# EAGLE design top (EAGLE 7.2.0)
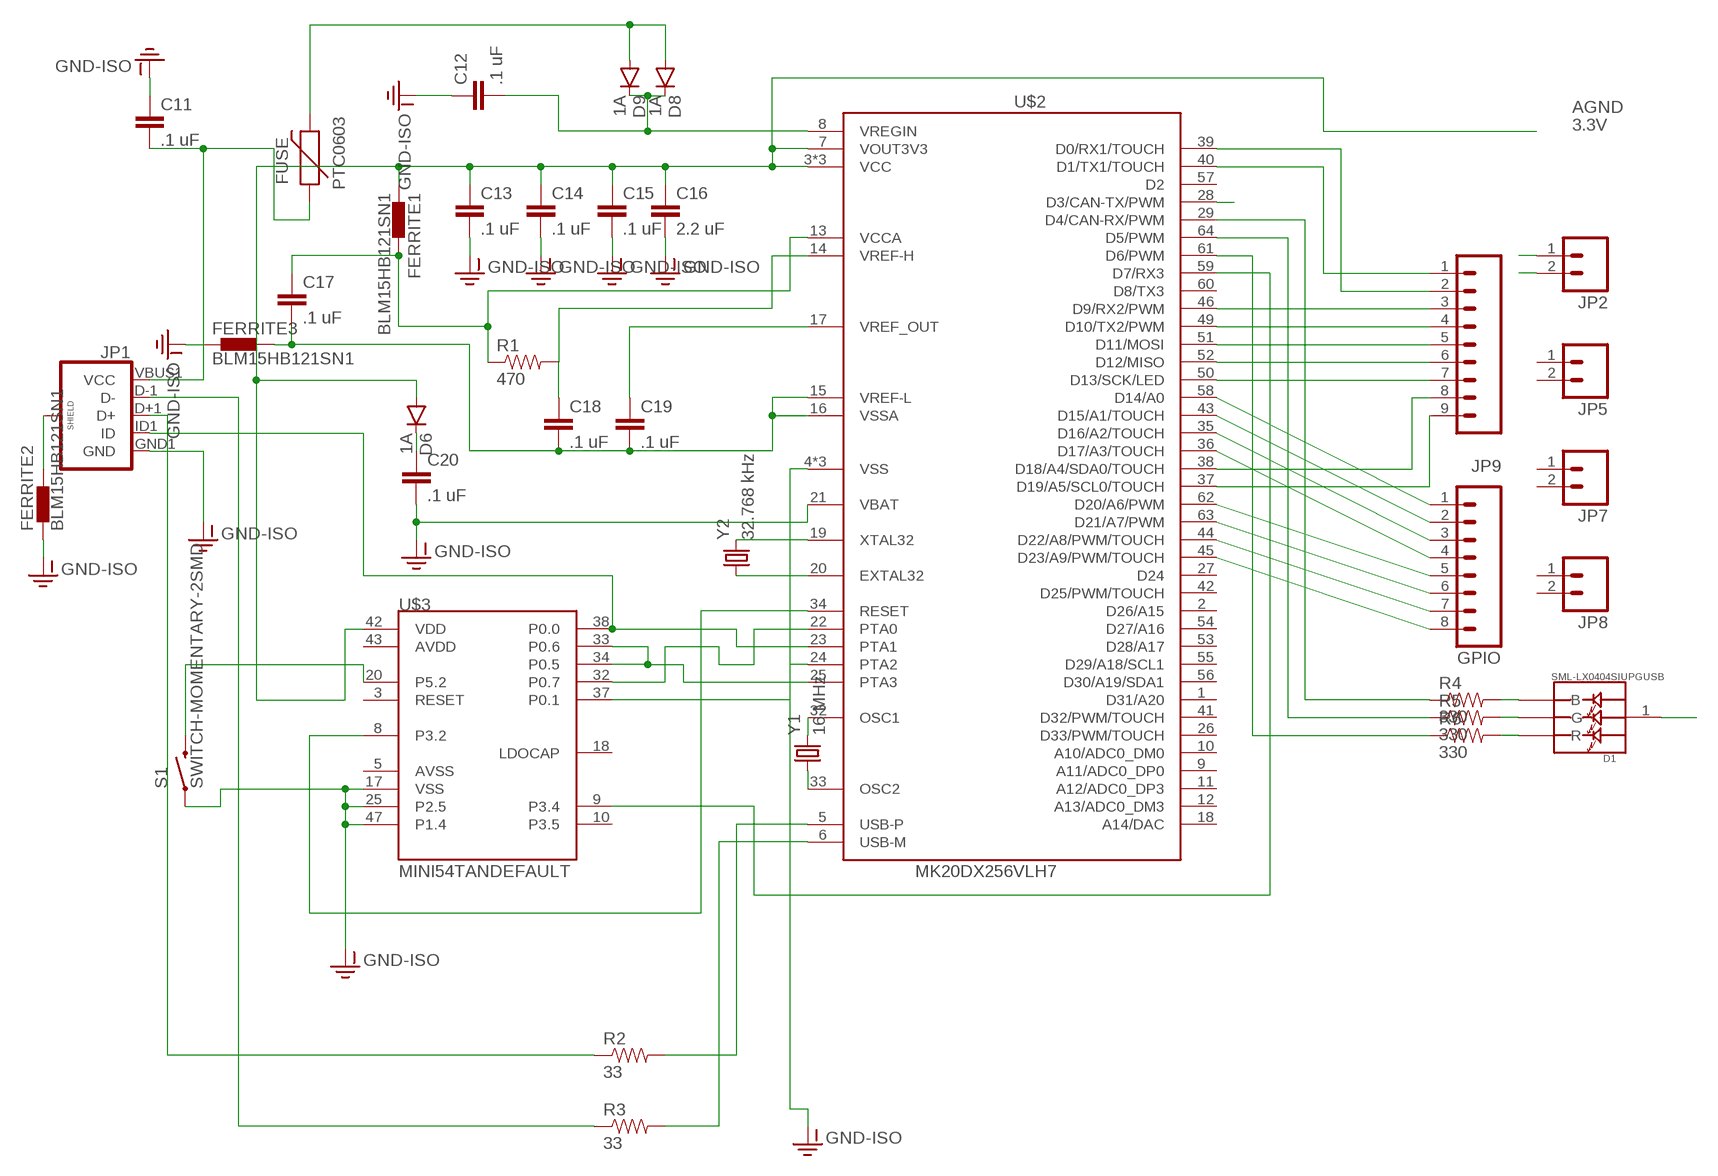
[diagram p0: schematic, sheet 1]

## Parts
C11  .1 uF  CAP0603-CAP  [0603-CAP]
C12  .1 uF  CAP0603-CAP  [0603-CAP]
C13  .1 uF  CAP0603-CAP  [0603-CAP]
C14  .1 uF  CAP0603-CAP  [0603-CAP]
C15  .1 uF  CAP0603-CAP  [0603-CAP]
C16  2.2 uF  CAP0603-CAP  [0603-CAP]
C17  .1 uF  CAP0603-CAP  [0603-CAP]
C18  .1 uF  CAP0603-CAP  [0603-CAP]
C19  .1 uF  CAP0603-CAP  [0603-CAP]
C20  .1 uF  CAP0603-CAP  [0603-CAP]
D1  SML-LX0404SIUPGUSB  [1MM_SQ_4PAD]
D6  1A  DIODEBAS16  [SOD-323]
D8  1A  DIODEBAS16  [SOD-323]
D9  1A  DIODEBAS16  [SOD-323]
FERRITE1  BLM15HB121SN1  [0402]
FERRITE2  BLM15HB121SN1  [0402]
FERRITE3  BLM15HB121SN1  [0402]
FUSE  PTC0603  [0603]
GPIO  M08SILK_FEMALE_PTH  [1X08]
JP1  USB_MICROB_PLUGCONN-11752  [USB-B-MICRO-SMD_V03]
JP2  M02LOCK  [1X02_LOCK]
JP5  M02LOCK  [1X02_LOCK]
JP7  M02LOCK  [1X02_LOCK]
JP8  M02LOCK  [1X02_LOCK]
JP9  M09  [1X09]
R1  470  RESISTOR0603  [0603-RES]
R2  33  RESISTOR0603  [0603-RES]
R3  33  RESISTOR0603  [0603-RES]
R4  330  RESISTOR0603  [0603-RES]
R5  330  RESISTOR0603  [0603-RES]
R6  330  RESISTOR0603  [0603-RES]
S1  SWITCH-MOMENTARY-2SMD  [TACTILE-SWITCH-SMD]
U$2  MK20DX256VLH7  [QFP50P1200X1200X160-64N]
U$3  MINI54TANDEFAULT  [QFP50P900X900X160-48N]
Y1  16 MHz  CRYSTAL5X3  [CRYSTAL-SMD-5X3]
Y2  32.768 kHz  CRYSTAL5X3  [CRYSTAL-SMD-5X3]

## Nets
3.3V: C13.1 C14.1 C15.1 C16.1 D1.1(VDD) D6.A FERRITE1.1 JP2.1 U$2.3(VCC) U$2.7(VOUT3V3) U$2.30(VCC) U$2.48(VCC) U$3.42(VDD)
AGND: C17.2 C18.2 C19.2 FERRITE3.2 U$2.15(VREF-L) U$2.16(VSSA)
CE: JP9.3 U$2.46(D9/RX2/PWM)
GND-ISO: C11.1 C12.1 C13.2 C14.2 C15.2 C16.2 C20.2 FERRITE2.1 FERRITE3.1 JP1.GND1(GND) JP2.2 S1.1 U$2.4(VSS) U$2.21(VBAT) U$2.31(VSS) U$2.47(VSS) U$3.17(VSS) U$3.25(P2.5) U$3.47(P1.4)
N$1: C19.1 U$2.17(VREF_OUT)
N$2: C12.2 D8.C D9.C U$2.8(VREGIN)
N$3: U$2.14(VREF-H)
N$4: C17.1 FERRITE1.2 R1.1 U$2.13(VCCA)
N$5: C18.1 R1.2
N$6: FERRITE2.2 JP1.SHIELD1(SHIELD) JP1.SHIELD2(SHIELD) JP1.SHIELD3(SHIELD)
N$8: S1.3 U$3.20(P5.2)
N$9: C20.1 D6.C
N$10: JP1.D+1(D+) R2.1
N$11: U$2.34(RESET) U$3.8(P3.2)
N$12: JP1.ID1(ID) U$2.23(PTA1) U$3.38(P0.0)
N$13: U$2.25(PTA3) U$3.33(P0.6) U$3.34(P0.5)
N$14: U$2.22(PTA0) U$3.32(P0.7)
N$15: U$2.24(PTA2) U$3.37(P0.1)
N$16: U$2.59(D7/RX3) U$3.9(P3.4)
N$18: JP1.D-1(D-) R3.1
N$19: R2.2 U$2.5(USB-P)
N$20: R3.2 U$2.6(USB-M)
N$22: JP9.4 U$2.49(D10/TX2/PWM)
N$23: U$2.19(XTAL32) Y2.3
N$24: U$2.20(EXTAL32) Y2.1
N$25: U$2.32(OSC1) Y1.3
N$26: U$2.33(OSC2) Y1.1
N$27: JP9.5 U$2.51(D11/MOSI)
N$28: JP9.6 U$2.52(D12/MISO)
N$29: GPIO.1 U$2.58(D14/A0)
N$30: GPIO.2 U$2.43(D15/A1/TOUCH)
N$31: GPIO.3 U$2.35(D16/A2/TOUCH)
N$32: D1.3(B) R4.2
N$33: D1.4(G) R5.2
N$35: D1.2(R) R6.2
N$36: GPIO.4 U$2.36(D17/A3/TOUCH)
N$37: GPIO.5 U$2.62(D20/A6/PWM)
N$38: GPIO.6 U$2.63(D21/A7/PWM)
N$39: GPIO.7 U$2.44(D22/A8/PWM/TOUCH)
N$40: GPIO.8 U$2.45(D23/A9/PWM/TOUCH)
N$41: R5.1 U$2.64(D5/PWM)
N$45: U$2.28(D3/CAN-TX/PWM)
N$62: R4.1 U$2.29(D4/CAN-RX/PWM)
N$63: C11.2 FUSE.1 JP1.VBUS1(VCC)
N$64: R6.1 U$2.61(D6/PWM)
SCK: JP9.7 U$2.50(D13/SCK/LED)
SCL_T: JP9.9 U$2.37(D19/A5/SCL0/TOUCH)
SDA_T: JP9.8 U$2.38(D18/A4/SDA0/TOUCH)
T_RX: JP9.2 U$2.39(D0/RX1/TOUCH)
T_TX: JP9.1 U$2.40(D1/TX1/TOUCH)
VIN: D8.A D9.A FUSE.2
Unconnected: JP5.1 JP5.2 JP7.1 JP7.2 JP8.1 JP8.2 U$2.1(D31/A20) U$2.2(D26/A15) U$2.9(A11/ADC0_DP0) U$2.10(A10/ADC0_DM0) U$2.11(A12/ADC0_DP3) U$2.12(A13/ADC0_DM3) U$2.18(A14/DAC) U$2.26(D33/PWM/TOUCH) U$2.27(D24) U$2.41(D32/PWM/TOUCH) U$2.42(D25/PWM/TOUCH) U$2.53(D28/A17) U$2.54(D27/A16) U$2.55(D29/A18/SCL1) U$2.56(D30/A19/SDA1) U$2.57(D2) U$2.60(D8/TX3) U$3.3(RESET) U$3.5(AVSS) U$3.10(P3.5) U$3.18(LDOCAP) U$3.43(AVDD)

## Library data of the parts
C11-C20 = SparkFun-Passives:CAP: Capacitor Standard 0603 ceramic capacitor, and 0.1" leaded capacitor.
D1 = leds:SML-LX0404SIUPGUSB: 1mm^2 RGB LED; DIGIKEY: 67-2125-1-ND
D6 D8 D9 = SparkFun-DiscreteSemi:DIODE: Diode These are standard reverse protection diodes and small signal diodes. SMA package can handle up to about 1A. SOD-323 can handle about 200mA. What the SOD-323 package when ordering, there are some mfgs out there that are 5-pin packages.; PROD_ID: DIO-09646; VALUE: 250mA/100V
FERRITE1-FERRITE3 = inductors:BLM15H: EMIFIL (R) Chip Ferrite Bead for GHz Noise Source: http://www.murata.com/ Ferrite Bead BLM15H.pdf
FUSE = SparkFun-PowerIC:PTC: Resettable Fuse PTC Resettable Fuse. Spark Fun Electronics SKU : COM-08357
GPIO = SparkFun-Connectors:M08: Header 8 Standard 8-pin 0.1" header. Use with straight break away headers (SKU : PRT-00116), right angle break away headers (PRT-00553), swiss pins (PRT-00743), machine pins (PRT-00117), and female headers (PRT-00115).; PROD_ID: CONN-08438
JP1 = SparkFun-Connectors:USB_MICROB_PLUG: USB Micro-B connectors Some male, some female. Watch your step!; PROD_ID: CONN-11752
JP2 JP5 JP7 JP8 = SparkFun-Connectors:M02: Standard 2-pin 0.1" header. Use with - straight break away headers ( PRT-00116) - right angle break away headers (PRT-00553) - swiss pins (PRT-00743) - machine pins (PRT-00117) - female headers (PRT-00115) Molex polarized connector foot print use with: PRT-08233 with associated crimp pins and housings. 2.54_SCREWTERM for use with PRT-10571. 3.5mm Screw Terminal footprints for PRT-08084 5mm Screw Terminal footprints for use with PRT-08432
JP9 = SparkFun-Connectors:M09: Header 9 Standard 9-pin 0.1" header. Use with straight break away headers (SKU : PRT-00116), right angle break away headers (PRT-00553), swiss pins (PRT-00743), machine pins (PRT-00117), and female headers (PRT-00115).
R1-R6 = SparkFun-Resistors:RESISTOR: Resistor Basic schematic elements and footprints for 0603, 1206, and PTH resistors.
S1 = SparkFun-Electromechanical:SWITCH-MOMENTARY-2: Various NO switches- pushbuttons, reed, etc; PROD_ID: SWCH-08247
U$2 = Teensy_3_Series_Chip_v1.2:MK20DX256VLH7: This is a footprint for the MK20dx256VHL7, the chip at the heart of the Teensy 3.1. Notable upgrades over the Teensy 3.0 include more Flash Memory, RAM, a DAC output, additional ADC pins, etc. Remember, if you want to use USB, VOut3v3 has to be attached to the 3.3V bus.
U$3 = Teensy_3_Series_Chip_v1.2:MINI54TAN: MINI54TAN Bootloader from PJRC.com, preprogrammed with Teensy 3.0 bootloader. https://www.pjrc.com/store/ic_mini54_tqfp.html
Y1 Y2 = SparkFun-FreqCtrl:CRYSTAL: Various standard crystals. Proven footprints.; PROD_ID: XTAL-08218

## Board
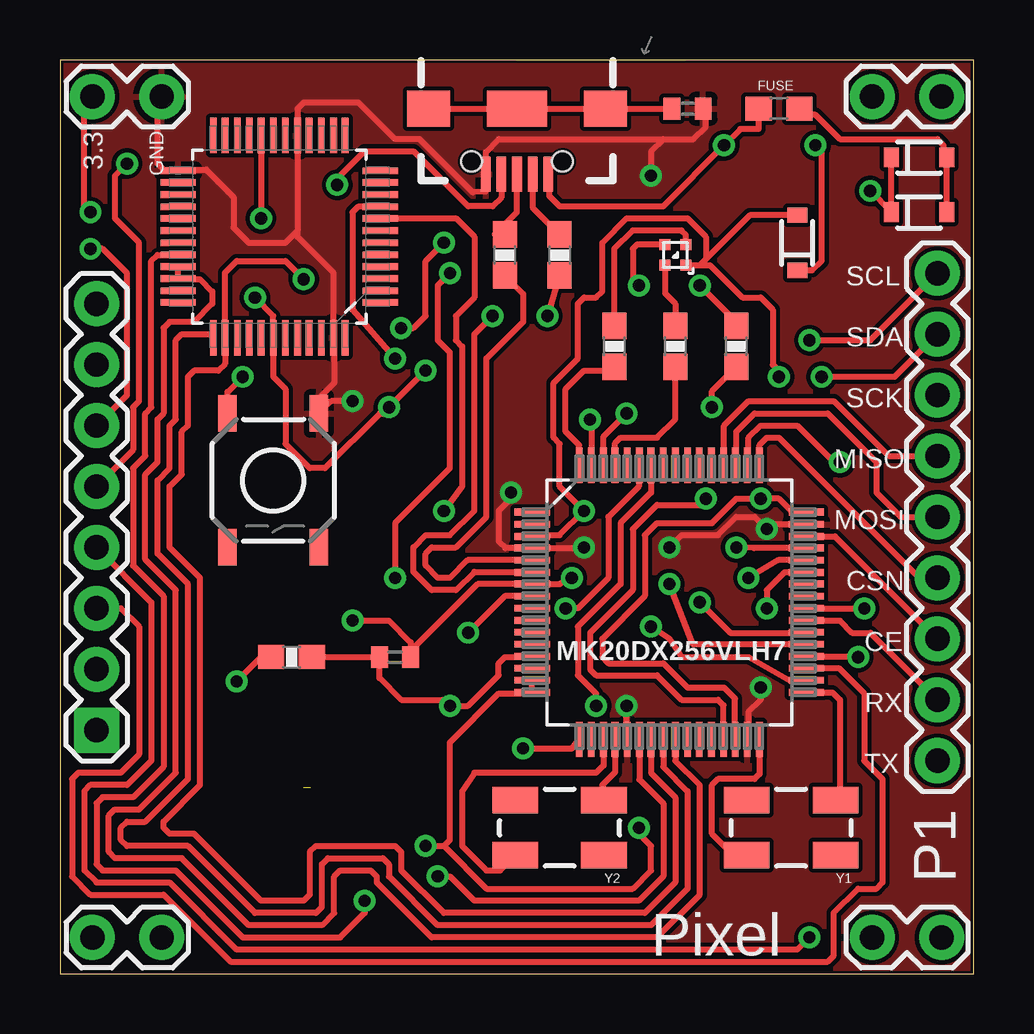
[diagram p1: board, top side]
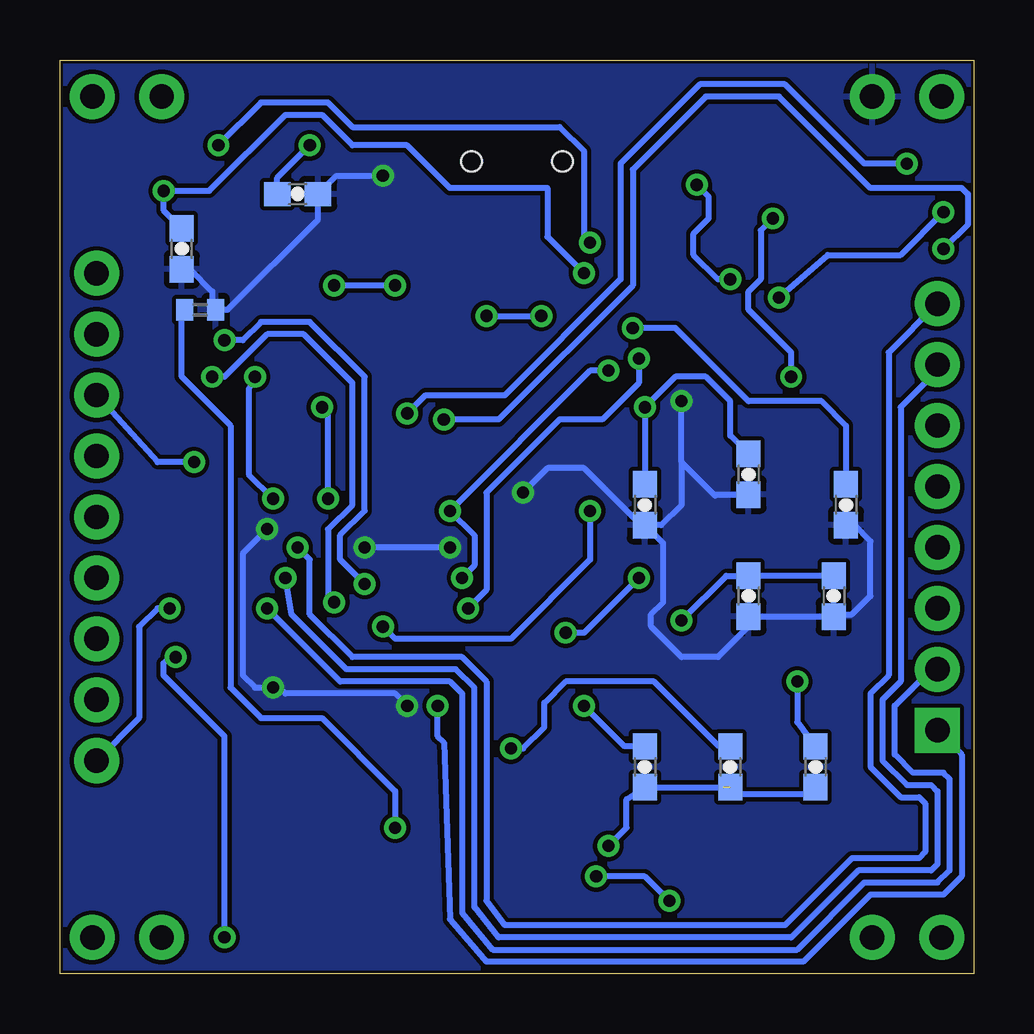
[diagram p2: board, bottom side, seen from below]

Size 38.1 x 38.1 mm. Coordinates in mm from the lower left corner, seen from the top.
Outline: 0,0 38.1,0 38.1,38.1 0,38.1 0,0
Copper layers (1*16): Top 0.035mm / dielectric 1.5mm / Bottom 0.035mm
Design rules "default *": minimum track width 10mil, minimum drill 20mil, track to track 7mil, track to pad 7mil, pad to pad 8mil, via to via 8mil, smd to smd 5mil, copper to edge 5mil, drill to drill 5mil, minimum pad ring 10mil, minimum via ring 8mil, stop-mask expansion 4mil, vias tented up to drill 0mil, thermal gap 10mil

### Footprints (pad centres in the part's own frame; a part is rotated, then mirrored left to right if it is on the bottom)
0603-CAP = smd 1.1 x 1: 1 -0.85,0; 2 0.85,0
1MM_SQ_4PAD = smd 0.457 x 0.457: 1 0.432,0.432; 2 0.432,-0.432; 3 -0.432,-0.432; 4 -0.432,0.432
SOD-323 = smd 0.63 x 0.83: A 1.15,0; C -1.15,0
0402 = smd 0.7 x 0.9: 1 -0.65,0; 2 0.65,0
0603 = smd 1.1 x 1: 1 -0.85,0; 2 0.85,0
1X08 = drill 1.016 pad 1.88 square: 1 0,0 | drill 1.016 pad 1.88: 2 2.54,0; 3 5.08,0; 4 7.62,0; 5 10.16,0; 6 12.7,0; 7 15.24,0; 8 17.78,0
USB-B-MICRO-SMD_V03 = smd 1.45 x 0.4: D+1 2.725,0; D-1 2.725,0.65; GND1 2.725,-1.3; ID1 2.725,-0.65; VBUS1 2.725,1.3 | smd 1.5 x 1.8: SHIELD1 0,3.685; SHIELD2 0,-3.685 | smd 1.5 x 2.5: SHIELD3 0,0 | hole 0.85: 2.2,1.9; 2.2,-1.9
1X02_LOCK = drill 1.016 pad 1.88: 1 -0.178,0; 2 2.718,0
1X09 = drill 1.016 pad 1.88: 1 0,0; 2 2.54,0; 3 5.08,0; 4 7.62,0; 5 10.16,0; 6 12.7,0; 7 15.24,0; 8 17.78,0; 9 20.32,0
0603-RES = smd 1.1 x 1: 1 -0.85,0; 2 0.85,0
TACTILE-SWITCH-SMD = smd 1.524 x 0.762: 1 -2.794,1.905; 2 2.794,1.905; 3 -2.794,-1.905; 4 2.794,-1.905
QFP50P1200X1200X160-64N = smd 1.473 x 0.279: 1 -5.715,3.759; 2 -5.715,3.251; 3 -5.715,2.743; 4 -5.715,2.261; 5 -5.715,1.753; 6 -5.715,1.245; 7 -5.715,0.762; 8 -5.715,0.254; 9 -5.715,-0.254; 10 -5.715,-0.762; 11 -5.715,-1.245; 12 -5.715,-1.753; 13 -5.715,-2.261; 14 -5.715,-2.743; 15 -5.715,-3.251; 16 -5.715,-3.759; 33 5.715,-3.759; 34 5.715,-3.251; 35 5.715,-2.743; 36 5.715,-2.261; 37 5.715,-1.753; 38 5.715,-1.245; 39 5.715,-0.762; 40 5.715,-0.254; 41 5.715,0.254; 42 5.715,0.762; 43 5.715,1.245; 44 5.715,1.753; 45 5.715,2.261; 46 5.715,2.743; 47 5.715,3.251; 48 5.715,3.759 | smd 0.279 x 1.473: 17 -3.759,-5.715; 18 -3.251,-5.715; 19 -2.743,-5.715; 20 -2.261,-5.715; 21 -1.753,-5.715; 22 -1.245,-5.715; 23 -0.762,-5.715; 24 -0.254,-5.715; 25 0.254,-5.715; 26 0.762,-5.715; 27 1.245,-5.715; 28 1.753,-5.715; 29 2.261,-5.715; 30 2.743,-5.715; 31 3.251,-5.715; 32 3.759,-5.715; 49 3.759,5.715; 50 3.251,5.715; 51 2.743,5.715; 52 2.261,5.715; 53 1.753,5.715; 54 1.245,5.715; 55 0.762,5.715; 56 0.254,5.715; 57 -0.254,5.715; 58 -0.762,5.715; 59 -1.245,5.715; 60 -1.753,5.715; 61 -2.261,5.715; 62 -2.743,5.715; 63 -3.251,5.715; 64 -3.759,5.715
QFP50P900X900X160-48N = smd 1.473 x 0.279: 1 -4.216,2.743; 2 -4.216,2.261; 3 -4.216,1.753; 4 -4.216,1.245; 5 -4.216,0.762; 6 -4.216,0.254; 7 -4.216,-0.254; 8 -4.216,-0.762; 9 -4.216,-1.245; 10 -4.216,-1.753; 11 -4.216,-2.261; 12 -4.216,-2.743; 25 4.216,-2.743; 26 4.216,-2.261; 27 4.216,-1.753; 28 4.216,-1.245; 29 4.216,-0.762; 30 4.216,-0.254; 31 4.216,0.254; 32 4.216,0.762; 33 4.216,1.245; 34 4.216,1.753; 35 4.216,2.261; 36 4.216,2.743 | smd 0.279 x 1.473: 13 -2.743,-4.216; 14 -2.261,-4.216; 15 -1.753,-4.216; 16 -1.245,-4.216; 17 -0.762,-4.216; 18 -0.254,-4.216; 19 0.254,-4.216; 20 0.762,-4.216; 21 1.245,-4.216; 22 1.753,-4.216; 23 2.261,-4.216; 24 2.743,-4.216; 37 2.743,4.216; 38 2.261,4.216; 39 1.753,4.216; 40 1.245,4.216; 41 0.762,4.216; 42 0.254,4.216; 43 -0.254,4.216; 44 -0.762,4.216; 45 -1.245,4.216; 46 -1.753,4.216; 47 -2.261,4.216; 48 -2.743,4.216
CRYSTAL-SMD-5X3 = smd 1.9 x 1.1: 1 -1.85,-1.15; 2 1.85,-1.15; 3 1.85,1.15; 4 -1.85,1.15

### Placement (x,y rotation side)
C11  28.19,32.51 180 bottom
C12  33.02,30.23 90 bottom
C13  13.72,19.56 270 bottom
C14  9.4,20.83 270 bottom
C15  9.4,15.75 270 bottom
C16  5.84,15.75 270 bottom
C17  13.72,8.64 270 bottom
C18  6.6,8.64 270 bottom
C19  10.16,8.64 270 bottom
C20  5.33,19.56 270 bottom
D1  25.65,29.97 270 top
D6  30.73,30.48 90 top
D8  35.81,31.75 0 top
D9  35.81,34.04 0 top
FERRITE1  13.97,13.21 180 top
FERRITE2  26.16,36.07 180 top
FERRITE3  32.26,27.69 180 bottom
FUSE  29.97,36.07 0 top
GPIO  1.52,10.16 90 top
JP1  19.05,36.07 270 top
JP2  1.52,36.58 0 top
JP5  34.04,36.58 0 top
JP7  34.04,1.52 0 top
JP8  1.52,1.52 0 top
JP9  36.58,8.89 90 top
R1  9.65,13.21 180 top
R2  18.54,29.97 270 top
R3  20.83,29.97 270 top
R4  28.19,26.16 90 top
R5  23.11,26.16 90 top
R6  25.65,26.16 90 top
S1  8.89,20.57 270 top
U$2  25.4,15.49 0 top
U$3  9.14,30.73 180 top
Y1  30.48,6.1 180 top
Y2  20.83,6.1 180 top

### Tracks (layer width: path | path; a pad name or v marks a point on that pad's centre or on a via)
3.3V  (via drill 0.51)
  Top 0.254: U$2.48 30.53,19.25 29.97,19.81 v29.21,19.81 28.19,19.81 27.18,18.8 24.89,18.8 24.38,18.29 24.38,15.75 22.61,13.97 22.61,13.21 22.86,12.95 25.15,12.95 26.16,11.94 27.69,11.94 28.14,11.48 U$2.30 | U$2.3 20.27,18.24 20.32,18.29 20.83,18.29 v21.84,19.3 20.83,20.32 20.83,22.1 20.57,22.35 20.57,24.64 21.59,25.65 21.59,27.94 21.84,28.19 22.35,28.19 22.61,28.45 22.61,30.48 23.62,31.5 26.16,31.5 26.92,30.73 26.92,29.79 | v21.34,16.51 20.83,16.26 U$2.7 17.41,16.26 14.62,13.46 FERRITE1.1 14.62,13.83 13.72,14.73 v12.19,14.73 | D1.1 26.67,29.54 | 26.67,29.54 27.1,29.54 28.45,28.19 29.21,28.19 29.72,27.69 29.72,25.4 29.97,25.15 v29.97,24.89 | 26.92,29.79 26.67,29.54 | v8.13,28.19 8.89,27.43 U$3.42 8.89,24.89 9.4,24.38 9.4,22.1 10.41,21.08 11.05,21.08 13.34,23.37 13.46,23.37 v13.72,23.62 v15.24,25.15 | D6.A 28.76,31.63 26.92,29.79 | v1.27,31.75 1.02,32 1.02,35.99 1.35,36.32 JP2.1
  Bottom 0.254: v29.21,19.81 30.23,20.83 30.23,24.38 v29.97,24.89 | 7.87,28.19 v8.13,28.19 6.1,29.97 3.05,29.97 v1.27,31.75 | v15.24,25.15 16,25.15 v21.84,19.3 20.83,18.29 20.83,17.02 v21.34,16.51 | v12.19,14.73 10.33,16.6 C15.1 C16.1 | C13.1 v13.72,23.62 12.45,24.89 11.18,24.89 10.16,23.88 10.16,22.44 C14.1
AGND  (via drill 0.51)  (1 unrouted)
  Top 0.254: U$2.15 U$2.16 19.63,11.68 18.29,11.68 16.26,9.65 16.26,5.59 16,5.33 | v15.24,5.33 16,5.33 | 16,5.33 17.78,3.56 23.88,3.56 24.64,4.32 24.64,5.33 24.13,5.84 v24.13,6.1
  Bottom 0.254: v15.24,5.33 14.48,6.1 14.48,7.28 C17.2 10.46,7.79 | FERRITE3.2 33.02,27.57 33.02,24.89 30.99,22.86 30.99,11.94 29.72,10.67 27.18,10.67 24.13,7.62 v24.13,6.1 | C18.2 7.15,7.49 9.86,7.49 C19.2
CE
  Top 0.254: U$2.46 32.31,18.24 JP9.3
GND-ISO  (via drill 0.51)
  Top 0.254: U$2.31 28.65,10.36 28.7,10.41 28.7,10.92 29.21,11.43 v29.21,11.94 | U$2.21 23.62,9.8 v23.62,11.18 | v21.84,17.78 21.36,17.75 U$2.4 18.57,17.75 18.29,18.03 18.29,19.3 18.8,19.81 v18.8,20.07 | U$2.47 29.67,18.75 v29.46,18.54 28.96,19.05 28.19,19.05 27.43,18.29 25.91,18.29 v25.4,17.78 | 25.15,34.8 18.29,34.8 17.75,34.26 JP1.GND1 17.75,32.62 17.2,32.58 14.99,34.8 13.97,34.8 12.45,36.32 10.16,36.32 9.91,36.07 U$3.17 9.91,30.99 | 25.15,34.8 26.42,34.8 26.92,35.31 26.92,35.96 FERRITE2.1 | 9.91,30.99 9.91,30.73 11.4,29.23 U$3.47 11.43,26.49 11.43,24.64 10.79,24 S1.1 11.3,23.88 v12.19,23.88 | 9.91,30.99 9.4,30.48 7.87,30.48 7.24,31.11 7.24,32.38 6.1,33.53 4.98,33.53 U$3.25 4.88,33.53 4.32,33.53 4.06,33.78 4.06,36.14 4.24,36.32 JP2.2 | 25.15,34.8 24.64,34.29 v24.64,33.27
  Bottom 0.254: v23.62,11.18 24.13,11.68 28.7,11.68 28.96,11.94 v29.21,11.94 29.97,11.94 30.48,12.45 30.48,17.53 v29.46,18.54 | v21.84,17.78 v25.4,17.78 | 12.19,21.34 10.79,19.94 10.75,19.98 C14.2 | 12.19,21.34 v12.19,23.88 | v18.8,20.07 17.78,21.08 16.26,21.08 13.97,18.8 13.8,18.8 C13.2 | v24.64,33.27 26.58,33.27 C11.1 27.34,31.45 31.11,27.69 FERRITE3.1 31.75,27.83 31.75,28.45 32.68,29.38 C12.1 | C13.2 12.95,17.95 12.95,15.49 13.46,14.99 13.46,14.48 12.19,13.21 10.67,13.21 9.4,14.48 C15.2 C16.2 5.75,14.99 5.08,14.99 4.32,15.75 4.32,18.03 4.99,18.71 C20.2 | 12.19,21.34 12.19,19.56 13.04,18.71 C13.2
  pour Bottom: -71.37,115.82 -77.72,115.82 -77.72,-51.82 192.02,-51.82 192.02,114.3 -71.37,114.3
  pour Top: -60.71,109.22 179.32,109.22 179.32,-43.94 -60.96,-43.94 -60.96,109.22
N$1  (via drill 0.51)
  Top 0.254: v19.3,9.4 21.34,9.4 21.59,9.73 U$2.17
  Bottom 0.254: v19.3,9.4 18.8,9.4 17.91,10.29 17.91,11.3 17.02,12.19 13.34,12.19 10.63,9.49 C19.1
N$2  (via drill 0.51)
  Top 0.254: D9.C D8.C v33.77,32.64 | U$2.8 18.54,15.75 v17.02,14.22 | v13.97,16.51 13.97,18.8 16.26,21.08 16.26,25.91 15.75,26.42 15.75,28.7 v16.26,29.21
  Bottom 0.254: 16.76,14.22 v17.02,14.22 16.26,14.22 v13.97,16.51 | v16.26,29.21 17.78,30.73 17.78,32.77 21.84,32.77 23.62,34.54 25.91,34.54 27.18,35.81 28.7,35.81 31.87,32.64 v33.77,32.64 33.77,31.83 C12.2
N$4  (via drill 0.51)
  Top 0.254: U$2.13 19.66,13.21 18.54,13.21 18.29,12.95 18.29,12.45 17.02,11.18 v16.26,11.18 16,11.43 14.22,11.43 13.32,12.33 FERRITE1.2 | FERRITE1.2 13.32,12.84 | R1.1 FERRITE1.2
  Bottom 0.254: v16.26,11.18 14.57,9.49 C17.1
N$5  (via drill 0.51)
  Top 0.254: R1.2 8.38,13.21 v7.37,12.19
  Bottom 0.254: v7.37,12.19 7.37,10.5 C18.1
N$6
  Top 0.254: JP1.SHIELD2 JP1.SHIELD3 JP1.SHIELD1 FERRITE2.2
N$8  (via drill 0.51)
  Top 0.254: U$3.20 v8.38,31.5 | S1.3 6.99,24.26 v7.62,24.89
  Bottom 0.254: v7.62,24.89 7.62,25.91 9.4,27.69 9.4,28.45 8.89,28.96 8.89,30.99 v8.38,31.5
N$9  (via drill 0.51)
  Top 0.254: v16,30.48 15.24,29.72 15.24,27.43 14.73,26.92 v14.22,26.92 | D6.C 31.36,29.33 31.75,29.72 31.75,34.29 v31.5,34.54
  Bottom 0.254: v14.22,26.92 12.45,26.92 9.4,23.88 6.35,23.88 5.33,22.86 C20.1 | v31.5,34.54 29.72,36.32 26.92,36.32 25.91,35.31 17.27,35.31 16.26,34.29 16.26,30.73 v16,30.48
N$10
  Top 0.254: R2.1 18.12,30.82 19.05,31.75 JP1.D+1
N$11  (via drill 0.51)
  Top 0.254: U$3.8 16.51,31.5 17.27,30.73 17.27,28.19 16.51,27.43 16.51,26.42 16.76,26.16 16.76,20.32 v16,19.3 | 31.06,12.19 U$2.34 30.53,12.24 30.48,12.19 28.7,13.21 25.91,13.21 25.4,13.97 v24.64,14.48
  Bottom 0.254: v16,19.3 16,17.27 19.3,13.97 24.13,13.97 v24.64,14.48
N$12  (via drill 0.51)
  Top 0.254: 6.86,26.49 U$3.38 | U$3.38 6.88,25.43 6.6,25.15 5.59,25.15 5.33,24.89 5.33,22.86 5.08,22.61 5.08,20.83 4.57,20.32 4.57,17.78 5.84,16.51 5.84,7.87 4.32,6.35 4.32,6.1 4.57,5.84 5.59,5.84 8.38,3.05 10.16,3.05 10.41,3.3 10.41,5.08 10.67,5.33 13.97,5.33 14.22,5.08 14.22,4.32 16,2.54 24.38,2.54 25.65,3.81 25.65,7.37 24.64,8.38 U$2.23 | U$3.38 6.88,29.23 7.37,29.72 9.4,29.72 v10.16,28.96 | v11.56,32.89 11.56,33.15 12.7,34.29 14.73,34.29 17.02,32 18.03,32 18.4,32.37 JP1.ID1
  Bottom 0.254: v10.16,28.96 10.67,28.96 11.68,29.97 11.68,30.86 11.05,31.5 11.05,32.38 v11.56,32.89
N$13
  Top 0.254: U$3.33 U$3.34 4.9,28.96 5.84,28.96 6.35,28.45 6.35,27.94 5.59,27.18 4.57,27.18 4.32,26.92 4.32,23.37 4.06,23.11 4.06,21.34 3.56,20.83 3.56,17.27 4.83,16 4.83,8.38 3.3,6.86 2.29,6.86 2.03,6.6 2.03,5.08 2.29,4.83 5.08,4.83 7.87,2.03 10.92,2.03 11.43,2.54 11.43,4.06 11.68,4.32 12.95,4.32 13.21,4.06 13.21,3.81 15.49,1.52 24.89,1.52 26.67,3.3 26.67,7.87 25.65,8.89 U$2.25
N$14  (via drill 0.51)
  Top 0.254: 24.13,9.75 U$2.22 24.16,8.1 25.15,7.11 25.15,4.06 24.13,3.05 17.27,3.05 16.26,4.06 v15.75,4.06 | U$3.32 4.06,29.97 3.81,29.72 3.81,23.62 3.56,23.37 3.56,21.59 3.05,21.08 3.05,17.02 4.32,15.75 4.32,8.64 3.05,7.37 1.78,7.37 1.52,7.11 1.52,4.57 1.78,4.32 4.83,4.32 7.62,1.52 11.68,1.52 12.7,2.54 v12.7,3.05
  Bottom 0.254: v15.75,4.06 13.72,4.06 v12.7,3.05
N$15
  Top 0.254: U$3.37 6.25,26.67 5.08,26.67 4.83,26.42 4.83,23.11 4.57,22.86 4.57,21.08 4.06,20.57 4.06,17.53 5.33,16.26 5.33,8.13 3.56,6.35 2.79,6.35 2.54,6.1 2.54,5.59 2.79,5.33 5.33,5.33 8.13,2.54 10.67,2.54 10.92,2.79 10.92,4.57 11.18,4.83 13.46,4.83 13.72,4.57 13.72,4.06 15.75,2.03 24.64,2.03 26.16,3.56 26.16,7.62 25.15,8.64 U$2.24
N$16  (via drill 0.51)
  Top 0.254: U$2.59 24.13,21.18 24.13,20.32 22.86,19.05 22.86,16.51 21.59,15.24 v21.08,15.24 | U$3.9 12.42,31.98 12.19,31.75 12.19,27.69 v13.97,25.65
  Bottom 0.254: v13.97,25.65 13.97,24.64 15.49,23.11 17.27,23.11 20.32,20.07 20.32,16 v21.08,15.24
N$18
  Top 0.254: JP1.D-1 19.7,31.95 R3.1
N$19
  Top 0.254: U$2.5 16.99,17.25 16.26,16.51 15.75,16.51 15.24,17.02 15.24,17.53 15.49,17.78 16.51,17.78 17.78,19.05 17.78,25.65 19.3,27.18 19.3,28.36 R2.2
N$20  (via drill 0.51)
  Top 0.254: R3.2 v20.32,27.43 | U$2.6 19.66,16.76 17.27,16.76 16.51,16 15.49,16 14.73,16.76 14.73,17.78 15.24,18.29 16.26,18.29 17.27,19.3 17.27,26.67 v18.03,27.43
  Bottom 0.254: v20.32,27.43 v18.03,27.43
N$22
  Top 0.254: JP9.4 35.81,16.51 29.97,22.35 29.46,22.35 29.16,22.05 U$2.49
N$23
  Top 0.254: U$2.19 22.66,8.69 22.35,8.38 17.27,8.38 16.76,7.62 16.76,5.33 17.78,4.32 18.35,4.32 Y2.3
N$24
  Top 0.254: U$2.20 23.14,8.41 22.61,7.87 22.61,7.17 Y2.1
N$25
  Top 0.254: Y1.3 28.07,4.95 27.18,5.84 27.18,7.87 27.43,8.13 28.96,8.13 29.16,8.33 U$2.32
N$26
  Top 0.254: U$2.33 32.21,11.73 32.51,11.43 32.51,7.43 Y1.1
N$27
  Top 0.254: U$2.51 28.19,21.26 28.19,22.61 28.96,23.37 32,23.37 34.04,21.34 34.04,20.07 35.05,19.05 JP9.5
N$28
  Top 0.254: U$2.52 27.69,21.23 27.69,22.86 28.7,23.88 32.26,23.88 34.54,21.59 JP9.6
N$29  (via drill 0.51)
  Top 0.254: U$2.58 24.64,20.07 23.37,18.8 23.37,16.26 21.59,14.48 21.59,12.45 22.35,11.68 v22.35,11.18
  Bottom 0.254: GPIO.1 0.51,9.14 0.51,4.06 1.27,3.3 4.32,3.3 7.11,0.51 20.32,0.51 21.84,2.29 22.1,9.65 22.35,9.91 v22.35,11.18
N$30  (via drill 0.51)
  Top 0.254: U$2.43 30.2,16.74 29.46,16 v29.46,15.24
  Bottom 0.254: GPIO.2 1.78,12.7 3.3,11.18 3.3,9.14 2.54,8.38 1.27,8.38 1.02,8.13 1.02,4.32 1.52,3.81 4.57,3.81 7.37,1.02 20.07,1.02 21.34,2.54 21.34,11.68 21.84,12.19 26.42,12.19 v29.46,15.24
N$31
  Top 0.254: U$2.35 32.46,12.75 33.53,11.68 33.53,8.89 34.29,8.13 34.29,3.81 34.04,3.56 33.27,3.56 32.26,2.54 32.26,0.76 32,0.51 7.11,0.51 4.32,3.3 1.27,3.3 0.51,4.06 0.51,8.13 0.76,8.38 2.54,8.38 3.3,9.14 3.3,14.48 2.54,15.24 GPIO.3
N$32  (via drill 0.51)
  Top 0.254: D1.3 24.05,30.4 23.88,30.23 23.88,28.96 v24.13,28.7 | v26.67,28.7 28.19,27.18 R4.2
  Bottom 0.254: v24.13,28.7 v26.67,28.7
N$33
  Top 0.254: R5.2 23.11,30.23 23.88,30.99 25.91,30.99 26.09,30.81 D1.4
N$35
  Top 0.254: D1.2 25.22,28.37 25.65,27.94 R6.2
N$36  (via drill 0.51)
  Top 0.254: GPIO.4 3.81,15.49 3.81,8.89 2.79,7.87 1.27,7.87 1.02,7.62 1.02,4.32 1.52,3.81 4.57,3.81 7.37,1.02 30.73,1.02 v31.24,1.52 | U$2.36 33.25,13.23 v33.27,13.21
  Bottom 0.254: v33.27,13.21 33.53,13.21 33.78,12.95 33.78,12.45 31.24,9.91 v31.24,1.52
N$37  (via drill 0.51)
  Top 0.254: U$2.62 22.66,22.4 v23.62,23.37 | GPIO.5 3.05,21.84 3.05,23.62 3.3,23.88 3.3,30.48 2.29,31.5 2.29,33.27 v2.79,33.78
  Bottom 0.254: v2.79,33.78 4.57,33.78 7.87,37.08 11.43,37.08 14.73,33.78 14.73,28.96 19.56,24.13 22.86,24.13 v23.62,23.37
N$38  (via drill 0.51)
  Top 0.254: GPIO.6 2.79,24.13 2.79,29.21 1.78,30.23 v1.27,30.23 | v22.1,23.11 22.15,22.81 U$2.63
  Bottom 0.254: v22.1,23.11 19.81,23.11 14.22,28.7 14.22,33.53 11.18,36.58 8.13,36.58 4.32,32.77 0.51,32.77 0.25,32.51 0.25,31.24 v1.27,30.23
N$39  (via drill 0.51)
  Top 0.254: U$2.44 29.95,17.25 v28.7,16.51
  Bottom 0.254: GPIO.7 1.52,25.15 3.05,23.62 3.05,12.19 3.81,11.43 3.81,8.89 2.79,7.87 1.78,7.87 1.52,7.62 1.52,4.57 1.78,4.32 4.83,4.32 7.62,1.52 19.81,1.52 20.83,2.79 20.83,11.94 21.59,12.7 26.16,12.7 28.45,14.99 v28.7,16.51
N$40  (via drill 0.51)
  Top 0.254: U$2.45 28.93,17.75 v28.19,17.78
  Bottom 0.254: GPIO.8 3.56,25.91 3.56,12.45 4.32,11.68 4.32,8.64 3.05,7.37 2.29,7.37 2.03,7.11 2.03,5.08 2.29,4.83 5.08,4.83 7.87,2.03 19.56,2.03 20.32,3.05 20.32,12.19 21.34,13.21 25.91,13.21 27.69,14.99 27.69,17.27 v28.19,17.78
N$41
  Top 0.254: U$2.64 21.64,22.05 21.08,22.61 21.08,24.38 21.84,25.15 22.95,25.15 R5.1
N$62  (via drill 0.51)
  Top 0.254: U$2.29 27.66,11.2 27.43,11.43 25.91,11.43 24.89,12.45 22.35,12.45 22.1,12.7 22.1,14.22 23.88,16 23.88,18.54 24.89,19.56 26.67,19.56 v26.92,19.81 | v27.18,23.62 27.18,24.3 R4.1
  Bottom 0.254: v26.92,19.81 26.92,23.37 v27.18,23.62
N$63  (via drill 0.51)
  Top 0.254: JP1.VBUS1 20.39,33.34 20.39,32.44 20.83,32 25.15,32 v27.69,34.54 28.36,35.22 29.12,35.22 FUSE.1
  Bottom 0.254: v27.69,34.54 29.04,33.19 C11.2
N$64
  Top 0.254: R6.1 25.65,23.11 24.89,22.35 23.37,22.35 23.14,22.12 U$2.61
SCK  (via drill 0.51)
  Top 0.254: U$2.50 28.7,21.26 28.7,22.35 29.21,22.86 30.73,22.86 32.26,21.34 v32.51,21.34
  Bottom 0.254: v32.51,21.34 34.04,21.34 JP9.7
SCL_T  (via drill 0.51)
  Top 0.254: U$2.37 26.39,13.74 v25.4,16.26 | v31.24,26.42 33.78,26.42 JP9.9
  Bottom 0.254: v25.4,16.26 26.42,17.27 26.42,18.29 25.4,19.3 25.4,24.89 27.69,27.18 29.72,27.18 30.48,26.42 v31.24,26.42
SDA_T  (via drill 0.51)
  Top 0.254: U$2.38 31.09,14.22 27.94,14.22 v26.67,15.49 | v31.75,24.89 34.8,24.89 JP9.8
  Bottom 0.254: 31.5,24.89 v31.75,24.89 31.24,24.89 29.46,26.67 27.94,26.67 25.91,24.64 25.91,19.56 26.92,18.54 26.92,15.75 v26.67,15.49
T_RX
  Top 0.254: U$2.39 32.51,14.73 33.02,14.22 33.78,14.22 JP9.2
T_TX  (via drill 0.51)
  Top 0.254: U$2.40 v33.53,15.24
  Bottom 0.254: v33.53,15.24 34.04,15.24 34.8,14.48 34.8,10.67 JP9.1
VIN
  Top 0.254: D8.A D9.A 36.83,34.17 36.83,34.54 36.58,34.8 32.51,34.8 31.5,35.81 31.08,35.81 FUSE.2

### Text on the board
tNames: 3.3 | GND | SCL | SDA | SCK | MISO | MOSI | CSN | CE | RX | TX | P1 | Pixel
tValues: 8 | 7 | 6 | 5 | 4 | 3 | 2 | 1